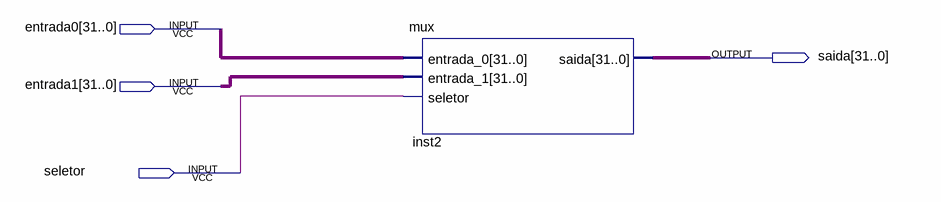
[diagram p0: schematic sheet]
// Quartus schematic teste_mux.bdf as structural Verilog: 1 symbols, 4 pins
module teste_mux (
  input  [31:0] entrada0,
  input  [31:0] entrada1,
  input  seletor,
  output [31:0] saida
);

  mux inst2 (.entrada_0(entrada0), .entrada_1(entrada1), .seletor(seletor), .saida(saida));
endmodule
